# Altium schematic sheet Bending_Machine_SCH.SchDoc
size A4; SheetNumber: 1; SheetTotal: 1
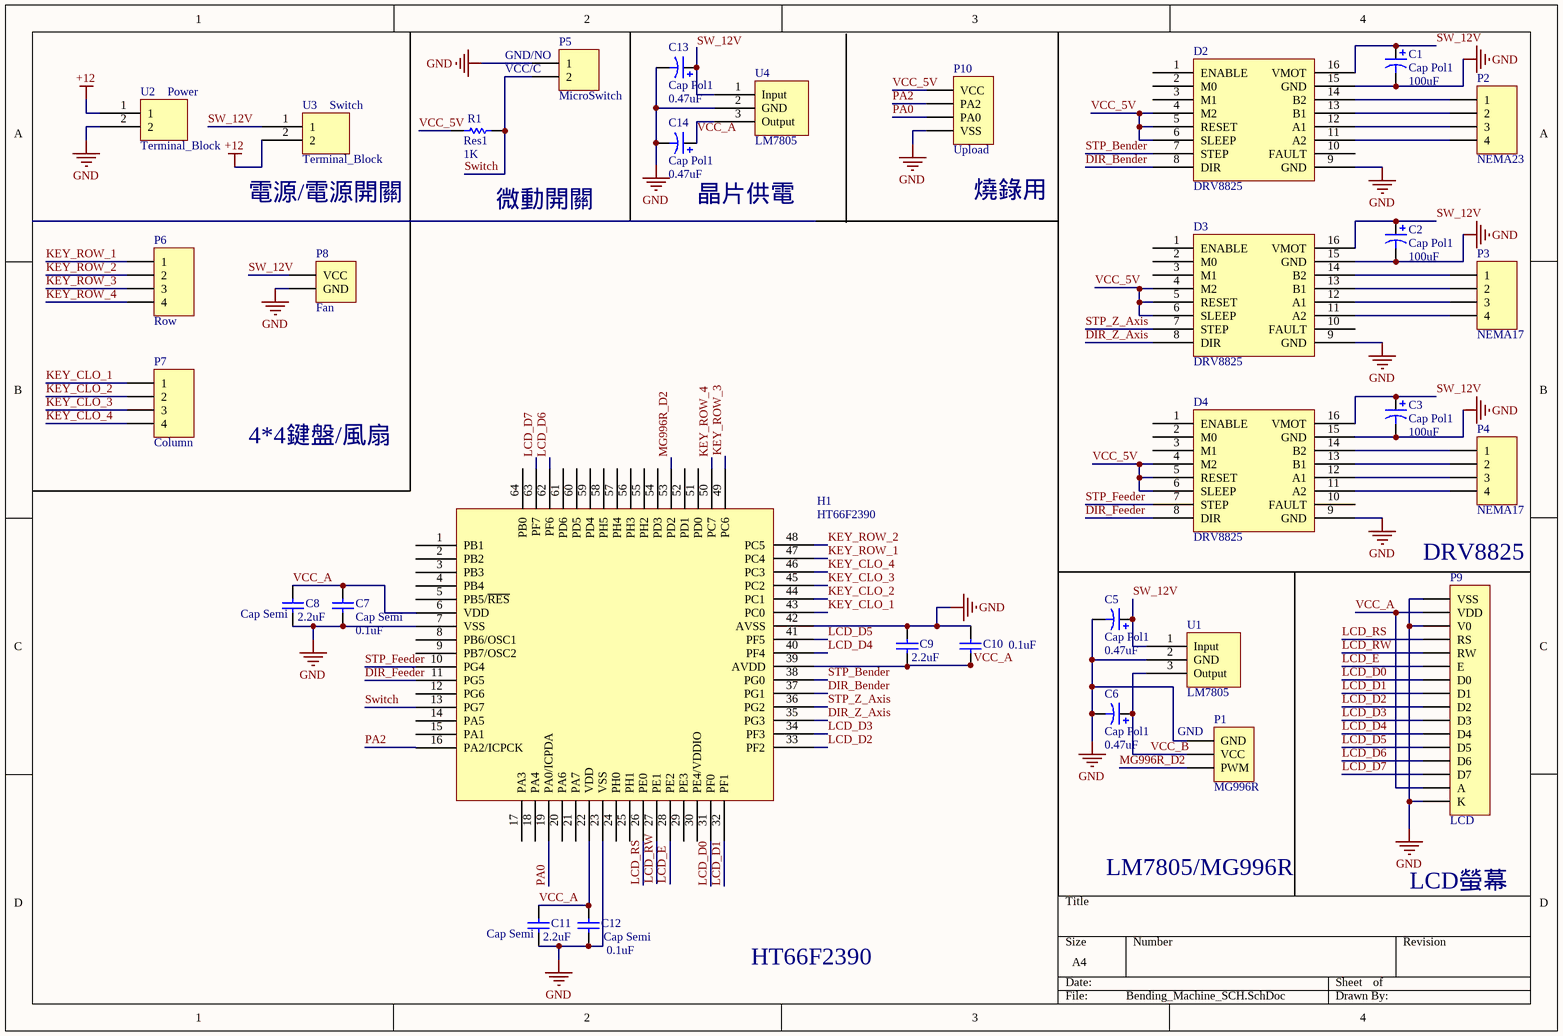
[diagram p0: Bending_Machine_SCH.SchDoc]

## Parts
C1  Cap Pol1  value 100uF  [Cap_100uF]
C2  Cap Pol1  value 100uF  [Cap_100uF]
C3  Cap Pol1  value 100uF  [Cap_100uF]
C5  Cap Pol1  value 0.47uF  [Cap_0.47uF]
C6  Cap Pol1  value 0.47uF  [Cap_0.47uF]
C7  Cap Semi  value 0.1uF  [1608[0603]]
C8  Cap Semi  value 2.2uF  [1608[0603]]
C9  value 2.2uF  [1608[0603]]  (hidden comment: Cap Semi)
C10  value 0.1uF  [1608[0603]]  (hidden comment: Cap Semi)
C11  Cap Semi  value 2.2uF  [1608[0603]]
C12  Cap Semi  value 0.1uF  [1608[0603]]
C13  Cap Pol1  value 0.47uF  [Cap_0.47uF]
C14  Cap Pol1  value 0.47uF  [Cap_0.47uF]
D2  DRV8825  [DRV8825]
D3  DRV8825  [DRV8825]
D4  DRV8825  [DRV8825]
H1  HT66F2390  [HT66F2390_Bord]
P1  MG996R  [HDR1X3]
P2  NEMA23  [HDR1X4]
P3  NEMA17  [HDR1X4]
P4  NEMA17  [HDR1X4]
P5  MicroSwitch  [HDR1X2]
P6  Row  [HDR1X4]
P7  Column  [HDR1X4]
P8  Fan  [HDR1X2]
P9  LCD  [HDR1X16]
P10  Upload  [HDR1X4]
R1  Res1  value 1K  [AXIAL-0.3]
U1  LM7805  [LM7805]
U2  Terminal_Block  [terminal block]
U3  Terminal_Block  [terminal block]
U4  LM7805  [LM7805]

## Nets
+12: U2.1 U3.2
GND: C1.2 C2.2 C3.2 C5.2 C6.2 C7.1 C8.1 C9.2 C10.2 C11.1 C12.1 C13.2 C14.2 D2.9(GND) D2.15(GND) D3.9(GND) D3.15(GND) D4.9(GND) D4.15(GND) H1.7(VSS) H1.23(VSS) H1.42(AVSS) P1.1(GND) P5.1 P8.2(GND) P9.1(VSS) P9.3(V0) P9.16(K) P10.4(VSS) U1.2(GND) U2.2 U4.2(GND)
DIR_Bender: D2.8(DIR) H1.37(PG1)
DIR_Feeder: D4.8(DIR) H1.11(PG5)
DIR_Z_Axis: D3.8(DIR) H1.35(PG3)
KEY_CLO_1: H1.43(PC0) P7.1
KEY_CLO_2: H1.44(PC1) P7.2
KEY_CLO_3: H1.45(PC2) P7.3
KEY_CLO_4: H1.46(PC3) P7.4
KEY_ROW_1: H1.47(PC4) P6.1
KEY_ROW_2: H1.48(PC5) P6.2
KEY_ROW_3: H1.49(PC6) P6.3
KEY_ROW_4: H1.50(PC7) P6.4
LCD_D0: H1.31(PF0) P9.7(D0)
LCD_D1: H1.32(PF1) P9.8(D1)
LCD_D2: H1.33(PF2) P9.9(D2)
LCD_D3: H1.34(PF3) P9.10(D3)
LCD_D4: H1.40(PF4) P9.11(D4)
LCD_D5: H1.41(PF5) P9.12(D5)
LCD_D6: H1.62(PF6) P9.13(D6)
LCD_D7: H1.63(PF7) P9.14(D7)
LCD_E: H1.28(PE2) P9.6(E)
LCD_RS: H1.26(PE0) P9.4(RS)
LCD_RW: H1.27(PE1) P9.5(RW)
MG996R_D2: H1.53(PD2) P1.3(PWM)
PA0: H1.19(PA0/ICPDA) P10.3(PA0)
PA2: H1.16(PA2/ICPCK) P10.2(PA2)
STP_Bender: D2.7(STEP) H1.38(PG0)
STP_Feeder: D4.7(STEP) H1.10(PG4)
STP_Z_Axis: D3.7(STEP) H1.36(PG2)
SW_12V: C1.1 C2.1 C3.1 C5.1 C13.1 D2.16(VMOT) D3.16(VMOT) D4.16(VMOT) P8.1(VCC) U1.1(Input) U3.1 U4.1(Input)
Switch: H1.13(PG7) P5.2 R1.2
VCC_5V: D2.4(M2) D2.5(RESET) D2.6(SLEEP) D3.4(M2) D3.5(RESET) D3.6(SLEEP) D4.4(M2) D4.5(RESET) D4.6(SLEEP) P10.1(VCC) R1.1
VCC_A: C7.2 C8.2 C9.1 C10.1 C11.2 C12.2 C14.1 H1.6(VDD) H1.22(VDD) H1.39(AVDD) P9.2(VDD) P9.15(A) U4.3(Output)
VCC_B: C6.1 P1.2(VCC) U1.3(Output)
NetD2_11: D2.11(A2) P2.4
NetD2_12: D2.12(A1) P2.3
NetD2_13: D2.13(B1) P2.2
NetD2_14: D2.14(B2) P2.1
NetD3_11: D3.11(A2) P3.4
NetD3_12: D3.12(A1) P3.3
NetD3_13: D3.13(B1) P3.2
NetD3_14: D3.14(B2) P3.1
NetD4_11: D4.11(A2) P4.4
NetD4_12: D4.12(A1) P4.3
NetD4_13: D4.13(B1) P4.2
NetD4_14: D4.14(B2) P4.1

Not connected (* = marked no-connect by the designer): D2 1(ENABLE) 2(M0) 3(M1) 10(FAULT); D3 1(ENABLE) 2(M0) 3(M1) 10(FAULT); D4 1(ENABLE) 2(M0) 3(M1) 10(FAULT); H1 1(PB1) 2(PB2) 3(PB3) 4(PB4) 5(PB5/~{RES}) 8(PB6/OSC1) 9(PB7/OSC2) 12(PG6) 14(PA5) 15(PA1) 17(PA3) 18(PA4) 20(PA6) 21(PA7) 24(PH0) 25(PH1) 29(PE3) 30(PE4/VDDIO) 51(PD0) 52(PD1) 54(PD3) 55(PH2) 56(PH3) 57(PH4) 58(PH5) 59(PD4) 60(PD5) 61(PD6) 64(PB0)

## Notes on the sheet
- (near U2) Power
- (near U3) Switch
- (near P5) VCC/C
- (near P5) GND/NO
- (near U3) 電源/電源開關
- 微動開關
- 晶片供電
- (near P10) 燒錄用
- 4*4鍵盤/風扇
- DRV8825
- (near P1) GND
- LM7805/MG996R
- LCD螢幕
- HT66F2390

## Library data of the parts
C1-C3 C5 C6 C13 C14 = Cap Pol1: Polarized Capacitor (Radial); Published: 8-Jun-2000; LatestRevisionDate: 17-Jul-2002; LatestRevisionNote: Re-released for DXP Platform.; PackageReference: RB7.6-15; Publisher: Altium Limited; PackageDescription: Polarized Capacitor (Radial); 2 Leads
C7-C12 = Cap Semi: Capacitor (Semiconductor SIM Model); Published: 8-Jun-2000; LatestRevisionDate: 29-May-2009; LatestRevisionNote: IPC-7351 Footprint Added.; PackageReference: C1206; Publisher: Altium Limited; PackageDescription: Chip Capacitor
P1 = Header 3: Header, 3-Pin; LatestRevisionDate: 17-Jul-2002; LatestRevisionNote: Re-released for DXP Platform.; Publisher: Altium Limited
P2-P4 P6 P7 P10 = Header 4: Header, 4-Pin; LatestRevisionDate: 17-Jul-2002; LatestRevisionNote: Re-released for DXP Platform.; Publisher: Altium Limited
P5 P8 = Header 2: Header, 2-Pin; LatestRevisionDate: 17-Jul-2002; LatestRevisionNote: Re-released for DXP Platform.; Publisher: Altium Limited
P9 = Header 16: Header, 16-Pin; LatestRevisionDate: 17-Jul-2002; LatestRevisionNote: Re-released for DXP Platform.; Publisher: Altium Limited
R1 = Res1: Resistor; Published: 8-Jun-2000; LatestRevisionDate: 17-Jul-2002; LatestRevisionNote: Re-released for DXP Platform.; PackageReference: AXIAL-0.3; Publisher: Altium Limited; PackageDescription: Axial Device, Thru-Hole; 2 Leads; 0.3 in Pin Spacing
U2 U3 = Terminal Block